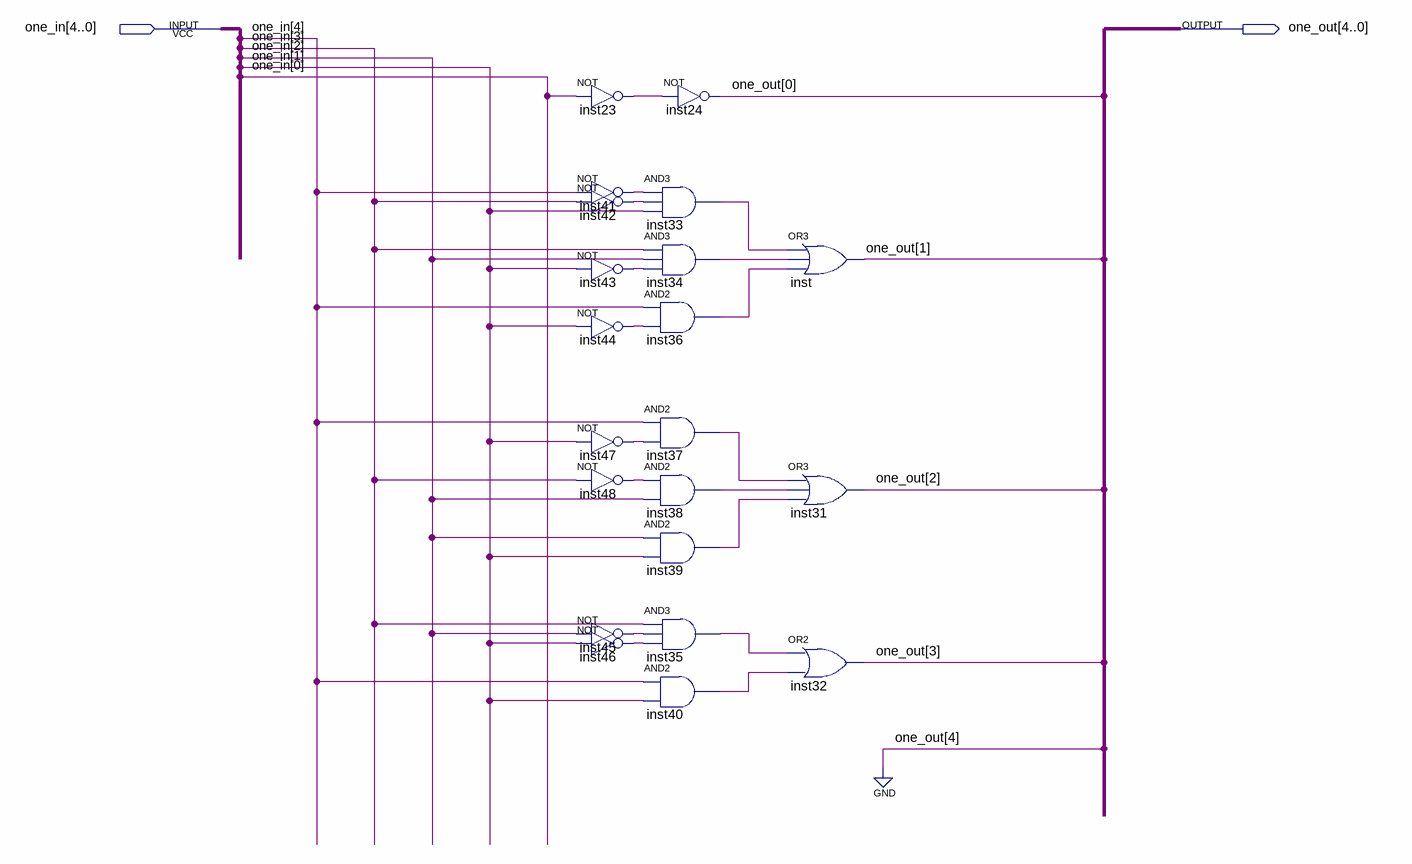
[diagram p0: schematic sheet]
// Quartus schematic mapping.bdf as structural Verilog: 21 symbols, 2 pins
module mapping (
  input  [4:0] one_in,
  output [4:0] one_out
);

  wire inst23_out, inst33_out, inst34_out, inst35_out, inst36_out, inst37_out, inst38_out, inst39_out,
       inst40_out, inst41_out, inst42_out, inst43_out, inst44_out, inst45_out, inst46_out, inst47_out,
       inst48_out;

  not inst23 (inst23_out, one_in[0]);
  not inst41 (inst41_out, one_in[4]);
  not inst42 (inst42_out, one_in[3]);
  not inst43 (inst43_out, one_in[1]);
  not inst44 (inst44_out, one_in[1]);
  not inst47 (inst47_out, one_in[1]);
  not inst48 (inst48_out, one_in[3]);
  not inst45 (inst45_out, one_in[2]);
  not inst46 (inst46_out, one_in[1]);
  not inst24 (one_out[0], inst23_out);
  and inst33 (inst33_out, inst41_out, inst42_out, one_in[1]);
  and inst34 (inst34_out, one_in[3], one_in[2], inst43_out);
  and inst36 (inst36_out, one_in[4], inst44_out);
  and inst37 (inst37_out, one_in[4], inst47_out);
  and inst38 (inst38_out, inst48_out, one_in[2]);
  and inst39 (inst39_out, one_in[2], one_in[1]);
  and inst35 (inst35_out, one_in[3], inst45_out, inst46_out);
  and inst40 (inst40_out, one_in[4], one_in[1]);
  or inst (one_out[1], inst33_out, inst34_out, inst36_out);
  or inst31 (one_out[2], inst37_out, inst38_out, inst39_out);
  or inst32 (one_out[3], inst35_out, inst40_out);

  assign one_out[4] = 1'b0;
endmodule
